# Altium schematic sheet Accelerometer.SchDoc
size A4; Author: Author Name; Organization: ORGANIZATION; Address1: ADDRESS 1; Address2: ADDRESS 2; Address3: ADDRESS 3; Address4: ADDRESS 4; Revision: -; SheetNumber: 2; SheetTotal: 6; ENG_APP_DATE: --/--/--; DSN_APP_DATE: --/--/--; CHK_APP_DATE: --/--/--
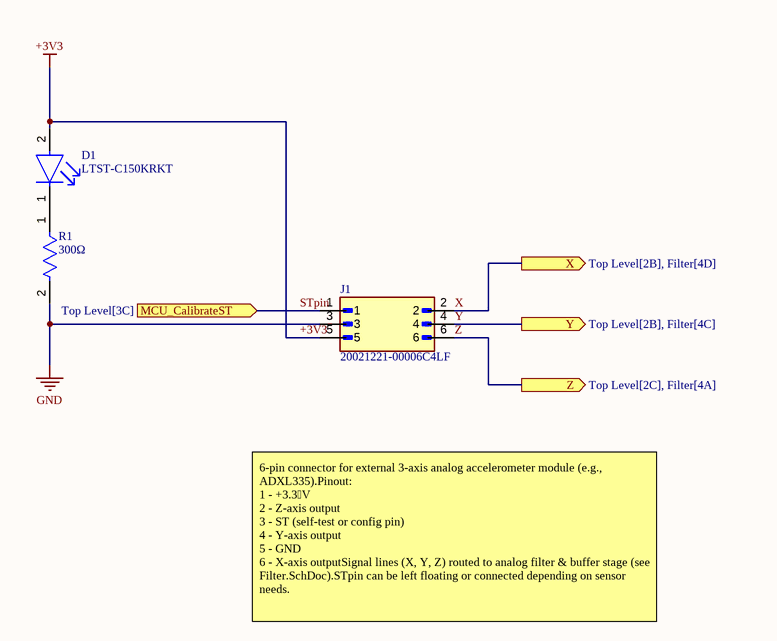
[diagram p0: Accelerometer.SchDoc]

## Parts
D1  LTST-C150KRKT  [FP-LTST-C150KRKT-MFG]
J1  20021221-00006C4LF  [AMPHENOL_20021221-00006C4LF]
R1  300Ω  [FP-RMCF0805-IPC_B]

## Ports
MCU_CalibrateST (in, see Top Level[3C]), X (out, see Top Level[2B], Filter[4D]), Y (out, see Top Level[2B], Filter[4C]), Z (out, see Top Level[2C], Filter[4A])

## Nets
+3V3: D1.2(A) J1.5
GND: J1.3 R1.2
STpin: J1.1 ; port MCU_CalibrateST
X: J1.2 ; port X
Y: J1.4 ; port Y
Z: J1.6 ; port Z
NetD1_1: D1.1(C) R1.1

## Notes on the sheet
- 6-pin connector for external 3-axis analog accelerometer module (e.g., ADXL335).Pinout:
  1 - +3.3 V
  2 - Z-axis output
  3 - ST (self-test or config pin)
  4 - Y-axis output
  5 - GND
  6 - X-axis outputSignal lines (X, Y, Z) routed to analog filter & buffer stage (see Filter.SchDoc).STpin can be left floating or connected depending on sensor needs.
- DWG. NO.
- REV.
- SHT.
- THIS DOCUMENT AND THE DATA DISCLOSED HEREIN OR HEREWITH IS THE PROPERTY OF ALTIUM LIMITED AND MAY BE FREELY DISTRIBUTED IN WHOLE. NO RIGHTS ARE RESERVED OR EXPRESS OR IMPLIED WARANTEE GIVEN.
- REVISION
- DESCRIPTION
- DATE
- APPROVED
- ENG:
- APPROVALS
- PROJECT
- DSN:
- CHK:
- REFERENCE DOCUMENTS
- PROJECT REVISION:
- TITLE
- DOCUMENT REVISION:
- DESIGN ITEM:
- BOM:
- FAB DWG:
- PCB DWG:
- ASSY DWG:
- SCALE:
- SIZE
- B
- CAGE CODE
- FILE NAME
- DWG NO.
- SHEET
- OF
- REV

## Library data of the parts
D1 = CMP-2000-06617-2: LED RED CLEAR 1206 SMD; Wavelength: 639nm; Power Dissipation: 62.5mW; Luminous Intensity: 54mcd; Test Current: 20mA; Forward Current: 30mA; Reverse Voltage: 5V; Viewing Angle: 130°; Number of Elements: 1; Lens Style: Diffused; Power Rating: 75mW; Lens Color: Colorless; Forward Voltage: 2V; Dominant Wavelength: 631nm; Depth: 1.6mm; Mount: Surface Mount; Packaging: Tape and Reel; Case Code (Metric): 3216; Lens Transparency: Clear; Illumination Color: Red; Radiation Hardening: No; Min Operating Temperature: -30°C; Height: 1.1mm; Case Code (Imperial): 1206; Number of Pins: 2; Length: 3.2mm; Lead Free: Lead Free; Color: Red; Width: 1.6mm; Number of LEDs: 1; Max Operating Temperature: 85°C; Case/Package: 1206; Package Quantity: 1
J1 = 20021221-00006C4LF: MF: Amphenol ICC; Package: None; Value: *; MP: 20021221-00006C4LF; Price: None; Availability: Unavailable
R1 = CMP-26527-003681-1: 300Ω ±5% 0.125W 0805 Thick Film Chip Resistor AEC-Q200 compliant, RMCF0805JT300R; Temperature Coefficient: 200ppm/°C; Resistance: 300R; Max Power Dissipation: 125mW; Tolerance: 5%; Features: Automotive AEC-Q200; Radiation Hardening: No; Case/Package: 0805; Mount: Surface Mount; Number of Terminations: 2; RoHS Compliant: Yes; Resistor Type: Thick Film; Length: 0.079inch; Height: 0.026inch; Width: 0.049inch; Package Quantity: 5000; Series: RMCF; Case Code (Metric): 2012; Max Operating Temperature: 155°C; Packaging: Tape and Reel; Contact Plating: Tin; Case Code (Imperial): 0805; Min Operating Temperature: -55°C